# EAGLE design deck (EAGLE 9.1.1)
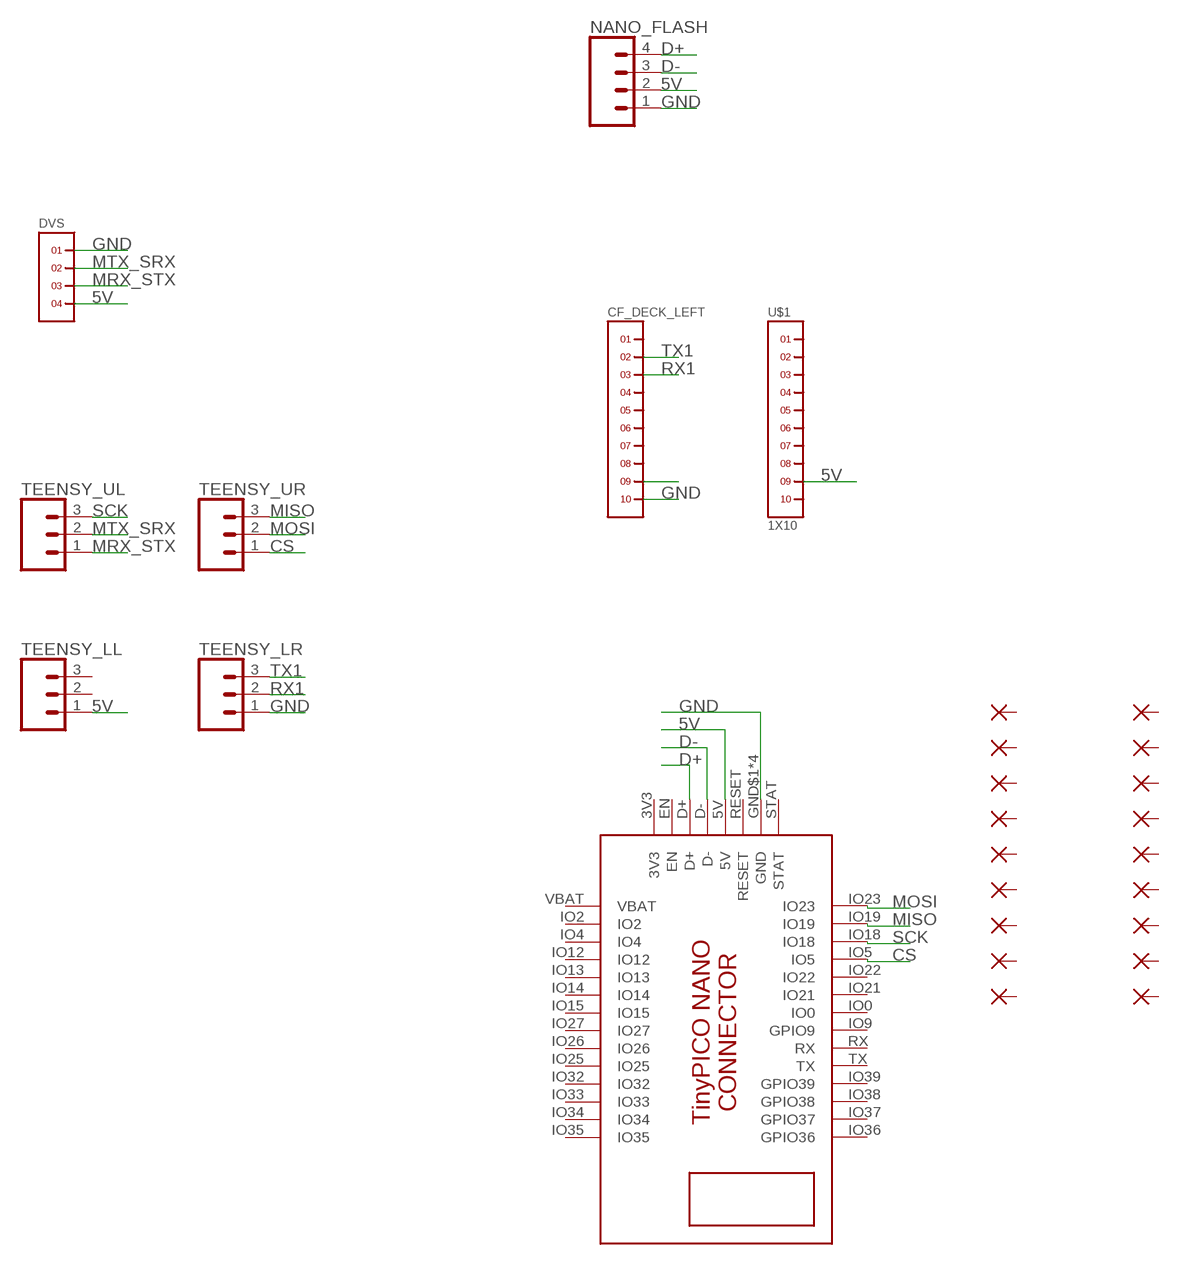
[diagram p0: schematic, sheet 1]

## Parts
CF_DECK_LEFT  1X10  [1X10]
DVS  1X4  [1X4]
NANO_FLASH  CONN_041X04_NO_SILK  [1X04_NO_SILK]
PAD1  SMD2  [SMD1,27-2,54]
PAD2  SMD2  [SMD1,27-2,54]
PAD3  SMD2  [SMD1,27-2,54]
PAD4  SMD2  [SMD1,27-2,54]
PAD5  SMD2  [SMD1,27-2,54]
PAD6  SMD2  [SMD1,27-2,54]
PAD7  SMD2  [SMD1,27-2,54]
PAD8  SMD2  [SMD1,27-2,54]
PAD9  SMD2  [SMD1,27-2,54]
PAD10  SMD2  [SMD1,27-2,54]
PAD11  SMD2  [SMD1,27-2,54]
PAD12  SMD2  [SMD1,27-2,54]
PAD13  SMD2  [SMD1,27-2,54]
PAD14  SMD2  [SMD1,27-2,54]
PAD15  SMD2  [SMD1,27-2,54]
PAD16  SMD2  [SMD1,27-2,54]
PAD17  SMD2  [SMD1,27-2,54]
PAD18  SMD2  [SMD1,27-2,54]
TEENSY_LL  CONN_031X03_NO_SILK  [1X03_NO_SILK]
TEENSY_LR  CONN_031X03_NO_SILK  [1X03_NO_SILK]
TEENSY_UL  CONN_031X03_NO_SILK  [1X03_NO_SILK]
TEENSY_UR  CONN_031X03_NO_SILK  [1X03_NO_SILK]
U$1  1X10  [1X10]
U$4  TINYPICO-NANO-CONNECTOR  [TINYPICO-NANO-CONNECTOR]

## Nets
5V: DVS.4 NANO_FLASH.2 TEENSY_LL.1 U$1.9 U$4.5V
CS: TEENSY_UR.1 U$4.IO5
D+: NANO_FLASH.4 U$4.D+
D-: NANO_FLASH.3 U$4.D-
GND: CF_DECK_LEFT.10 DVS.1 NANO_FLASH.1 TEENSY_LR.1 U$4.GND$1(GND) U$4.GND$2(GND) U$4.GND$3(GND) U$4.GND$4(GND)
IO_4: CF_DECK_LEFT.9
MISO: TEENSY_UR.3 U$4.IO19
MOSI: TEENSY_UR.2 U$4.IO23
MRX_STX: DVS.3 TEENSY_UL.1
MTX_SRX: DVS.2 TEENSY_UL.2
RX1: CF_DECK_LEFT.3 TEENSY_LR.2
SCK: TEENSY_UL.3 U$4.IO18
TX1: CF_DECK_LEFT.2 TEENSY_LR.3
Unconnected: CF_DECK_LEFT.1 CF_DECK_LEFT.4 CF_DECK_LEFT.5 CF_DECK_LEFT.6 CF_DECK_LEFT.7 CF_DECK_LEFT.8 PAD1.1(P) PAD2.1(P) PAD3.1(P) PAD4.1(P) PAD5.1(P) PAD6.1(P) PAD7.1(P) PAD8.1(P) PAD9.1(P) PAD10.1(P) PAD11.1(P) PAD12.1(P) PAD13.1(P) PAD14.1(P) PAD15.1(P) PAD16.1(P) PAD17.1(P) PAD18.1(P) TEENSY_LL.2 TEENSY_LL.3 U$1.1 U$1.2 U$1.3 U$1.4 U$1.5 U$1.6 U$1.7 U$1.8 U$1.10 U$4.EN U$4.IO0 U$4.IO2 U$4.IO4 U$4.IO9(GPIO9) U$4.IO12 U$4.IO13 U$4.IO14 U$4.IO15 U$4.IO21 U$4.IO22 U$4.IO25 U$4.IO26 U$4.IO27 U$4.IO32 U$4.IO33 U$4.IO34 U$4.IO35 U$4.IO36(GPIO36) U$4.IO37(GPIO37) U$4.IO38(GPIO38) U$4.IO39(GPIO39) U$4.RESET U$4.RX U$4.STAT U$4.TX

## Power pins joined to a net without a drawn wire
3V3: U$4.3V3
VBAT: U$4.VBAT

## Library data of the parts
CF_DECK_LEFT U$1 = headers(2mm):1X10
DVS = headers(2mm):1X4
NANO_FLASH = SparkFun-Connectors:CONN_04: Multi connection point. Often used as Generic Header-pin footprint for 0.1 inch spaced/style header connections On any of the 0.1 inch spaced packages, you can populate with these: Break Away Headers - Straight <https://www.sparkfun.com/products/116> (PRT-00116) Break Away Male Headers - Right Angle <https://www.sparkfun.com/products/553> (PRT-00553) Female Headers <https://www.sparkfun.com/products/115> (PRT-00115) Break Away Headers - Machine Pin <https://www.sparkfun.com/products/117> (PRT-00117) Break Away Female Headers - Swiss Machine Pin <https://www.sparkfun.com/products/743> (PRT-00743) For SCREWTERMINALS and SPRING TERMINALS visit here: Screw Terimnals on SparkFun.com <https://www.sparkfun.com/search/results?term=Screw+Terminals> (5mm/3.5mm/2.54mm spacing) This device is also useful as a general connection point to wire up your design to another part of your project. Our various solder wires solder well into these plated through hole pads. Hook-Up Wire - Assortment (Stranded, 22 AWG) <https://www.sparkfun.com/products/11375> (PRT-11375) Hook-Up Wire - Assortment (Solid Core, 22 AWG) <https://www.sparkfun.com/products/11367> (PRT-11367) View the entire wire category on our website here <https://www.sparkfun.com/categories/141> Special notes: Molex polarized connector foot print use with SKU : PRT-08231 with associated crimp pins and housings. 1MM SMD Version SKU: PRT-10208; PROD_ID: CONN-09696
PAD1-PAD18 = wirepad:SMD2: SMD PAD
TEENSY_LL TEENSY_LR TEENSY_UL TEENSY_UR = SparkFun-Connectors:CONN_03: Multi connection point. Often used as Generic Header-pin footprint for 0.1 inch spaced/style header connections On any of the 0.1 inch spaced packages, you can populate with these: Break Away Headers - Straight <https://www.sparkfun.com/products/116> (PRT-00116) Break Away Male Headers - Right Angle <https://www.sparkfun.com/products/553> (PRT-00553) Female Headers <https://www.sparkfun.com/products/115> (PRT-00115) Break Away Headers - Machine Pin <https://www.sparkfun.com/products/117> (PRT-00117) Break Away Female Headers - Swiss Machine Pin <https://www.sparkfun.com/products/743> (PRT-00743) Stackable Header - 3 Pin (Female, 0.1") <https://www.sparkfun.com/products/13875> (PRT-13875) For SCREWTERMINALS and SPRING TERMINALS visit here: Screw Terimnals on SparkFun.com <https://www.sparkfun.com/search/results?term=Screw+Terminals> (5mm/3.5mm/2.54mm spacing) This device is also useful as a general connection point to wire up your design to another part of your project. Our various solder wires solder well into these plated through hole pads. Hook-Up Wire - Assortment (Stranded, 22 AWG) <https://www.sparkfun.com/products/11375> (PRT-11375) Hook-Up Wire - Assortment (Solid Core, 22 AWG) <https://www.sparkfun.com/products/11367> (PRT-11367) View the entire wire category on our website here <https://www.sparkfun.com/categories/141> Special notes: Molex polarized connector foot print use with SKU : PRT-08232 with associated crimp pins and housings.
U$4 = TinyPICO_NANO_Eagle:TINYPICO-NANO-CONNECTOR: TinyPICO NANO Footprint https://www.tinypico.com/tinypico-nano

## Board
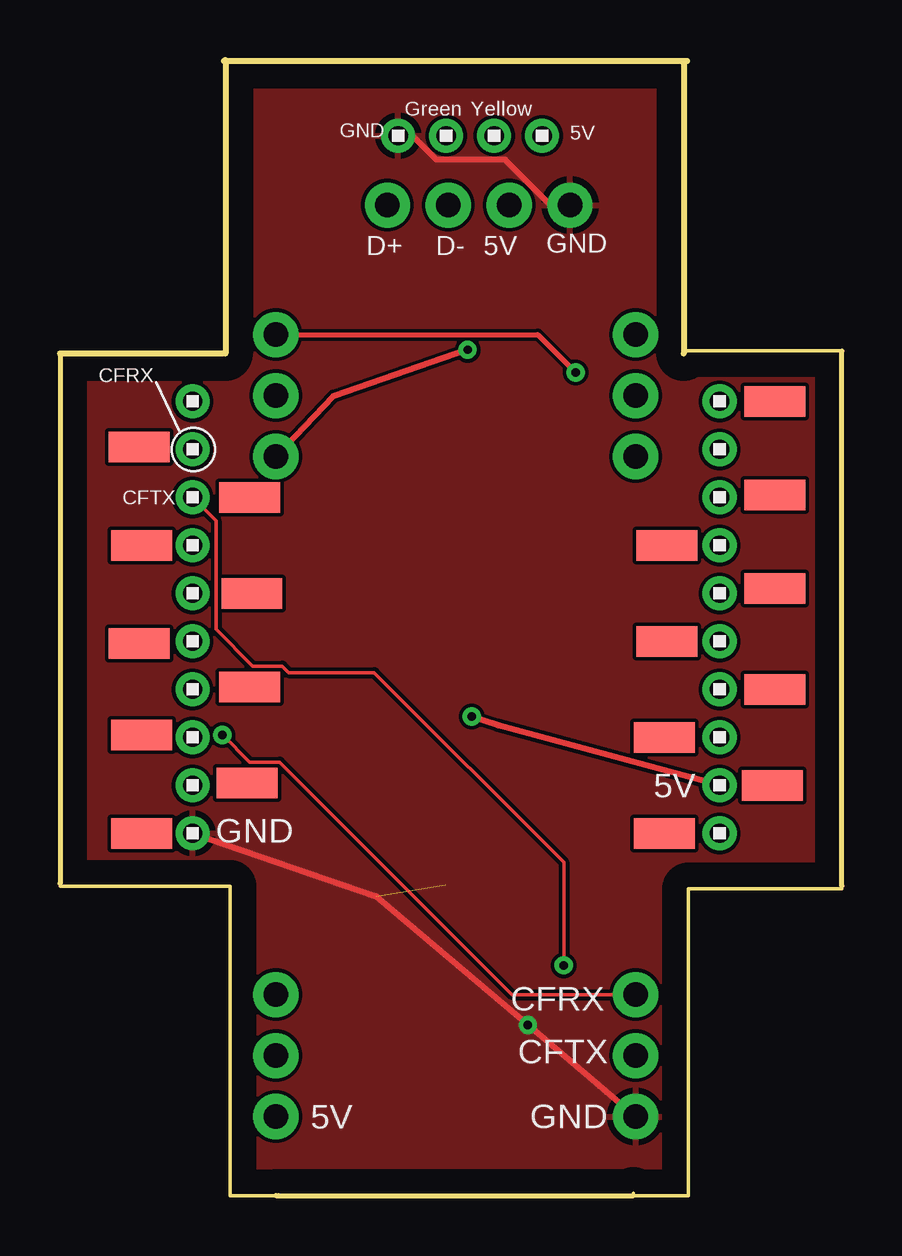
[diagram p1: board, top side]
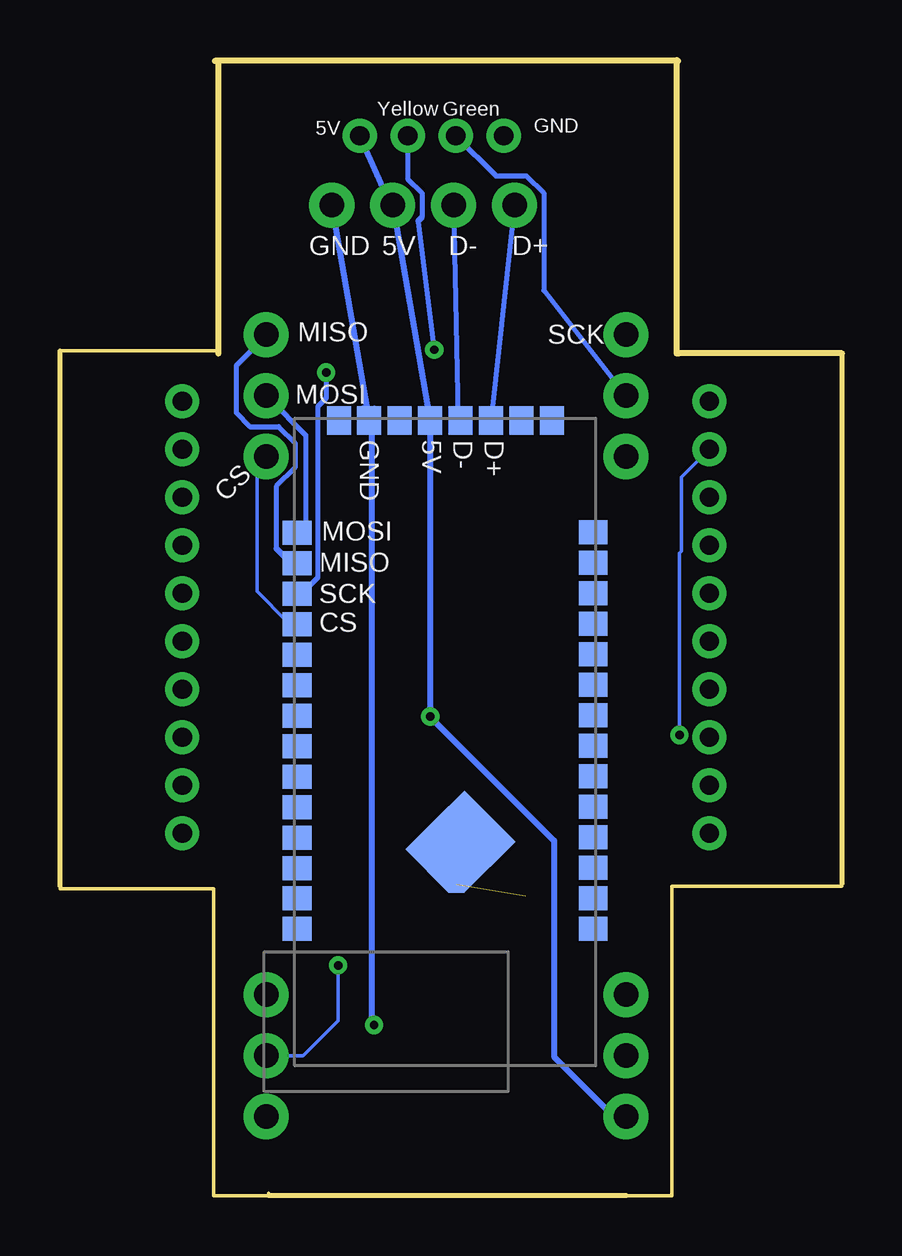
[diagram p2: board, bottom side, seen from below]

Size 32.6 x 47.32 mm. Coordinates in mm from the lower left corner, seen from the top.
Outline: 0,13 0,35.1 6.8,35.1
Outline: 9,0 9.1,0
Outline: 9.1,0 23.9,0
Outline: 32.6,12.9 32.6,35.2 26.1,35.2
Outline: 0,12.9 7.1,12.9 7.1,0 9.1,0
Outline: 32.6,12.8 26.2,12.8 26.2,0 23.9,0
Outline: 23.9,0 23.9,0.1
Outline: 6.9,47.32 6.9,35.1
Outline: 26,47.17 26,35.1
Outline: 6.83,47.28 26.14,47.28
Copper layers (1*16): Top 0.035mm / dielectric 1.5mm / Bottom 0.035mm
Design rules "default": minimum track width 6mil, minimum drill 0.35mm, track to track 6mil, track to pad 6mil, pad to pad 6mil, via to via 6mil, smd to smd 6mil, copper to edge 40mil, drill to drill 6mil, minimum pad ring 10mil, minimum via ring 8mil, stop-mask expansion 4mil, vias tented up to drill 0mil, thermal gap 10mil

### Footprints (pad centres in the part's own frame; a part is rotated, then mirrored left to right if it is on the bottom)
1X10 = drill 0.8 pad 1.422: 1 -9,0; 2 -7,0; 3 -5,0; 4 -3,0; 5 -1,0; 6 1,0; 7 3,0; 8 5,0; 9 7,0; 10 9,0
1X4 = drill 0.8 pad 1.422: 1 -3,0; 2 -1,0; 3 1,0; 4 3,0
1X04_NO_SILK = drill 1.016 pad 1.88: 1 0,0; 2 2.54,0; 3 5.08,0; 4 7.62,0
SMD1,27-2,54 = smd 1.27 x 2.54: 1 0,0
1X03_NO_SILK = drill 1.016 pad 1.88: 1 0,0; 2 2.54,0; 3 5.08,0
TINYPICO-NANO-CONNECTOR = smd 1.2 x 1: 3V3 0.1,10.725; 5V 0.1,5.645; D+ 0.1,8.185; D- 0.1,6.915; EN 0.1,9.455; GND$1 0.1,3.105; RESET 0.1,4.375; STAT 0.1,1.835 | smd 3 x 3 rotated 45: GND$2 17.643,7.082 | smd 0.66 x 0.671: GND$3 19.436,6.746 | smd 2.54 x 2.54 rotated 45: GND$4 17.971,6.413 | smd 1 x 1.2: IO0 12.395,0.1; IO2 6.034,12.44; IO4 7.304,12.44; IO5 8.585,0.1; IO9 13.665,0.1; IO12 8.574,12.44; IO13 9.844,12.44; IO14 11.114,12.44; IO15 12.384,12.44; IO18 7.315,0.1; IO19 6.045,0.1; IO21 11.125,0.1; IO22 9.855,0.1; IO23 4.775,0.1; IO25 16.194,12.44; IO26 14.924,12.44; IO27 13.654,12.44; IO32 17.464,12.44; IO33 18.734,12.44; IO34 20.004,12.44; IO35 21.274,12.44; IO36 21.285,0.1; IO37 20.015,0.1; IO38 18.745,0.1; IO39 17.475,0.1; RX 14.935,0.1; TX 16.205,0.1; VBAT 4.764,12.44

### Placement (x,y rotation side)
CF_DECK_LEFT  5.53,24.1 270 top
DVS  17.1,44.17 0 top
NANO_FLASH  21.27,41.28 180 top
PAD1  3.4,15.1 90 top
PAD2  7.8,17.2 90 top
PAD3  8,25.1 90 top
PAD4  7.9,29.1 90 top
PAD5  29.8,33.1 90 top
PAD6  29.8,29.2 90 top
PAD7  25.3,27.1 90 top
PAD8  25.3,23.1 90 top
PAD9  3.3,31.2 90 top
PAD10  3.4,19.2 90 top
PAD11  7.9,21.2 90 top
PAD12  3.4,27.1 90 top
PAD13  29.7,17.1 90 top
PAD14  25.2,19.1 90 top
PAD15  3.3,23 90 top
PAD16  29.8,21.1 90 top
PAD17  29.8,25.3 90 top
PAD18  25.2,15.1 90 top
TEENSY_LL  9,3.3 90 top
TEENSY_LR  24,3.3 90 top
TEENSY_UL  9,30.8 90 top
TEENSY_UR  24,30.8 90 top
U$1  27.5,24.1 270 top
U$4  22.81,32.4 270 bottom

### Tracks (layer width: path | path; a pad name or v marks a point on that pad's centre or on a via)
5V  (via drill 0.35)
  Top 0.254: U$1.9 18.26,19.6 v17.16,19.96
  Bottom 0.254: U$4.5V | U$4.5V v17.16,19.96 12,14.8 12,5.8 9.5,3.3 TEENSY_LL.1 | NANO_FLASH.2 18.67,40.95 | 18.67,40.95 U$4.5V | DVS.4 18.67,40.95
CS
  Bottom 0.152: U$4.IO5 22.82,23.92 23.12,23.92 24.38,25.18 24.38,30.42 TEENSY_UR.1
D+
  Bottom 0.203: NANO_FLASH.4 U$4.D+
D-
  Bottom 0.152: 16,32.41 U$4.D-
  Bottom 0.203: NANO_FLASH.3 16,32.41
GND  (via drill 0.35)  (1 unrouted)
  Top 0.152: 5.6,15.08 CF_DECK_LEFT.10
  Top 0.254: CF_DECK_LEFT.10 13.18,12.48 v19.5,7.12 TEENSY_LR.1 | NANO_FLASH.1 20.45,41.28 18.55,43.17 15.69,43.17 14.7,44.16 DVS.1
  Bottom 0.152: 19.77,32.8 19.77,32.76 U$4.GND$1 19.62,32.15 19.7,32.23 | 16.42,14.47 U$4.GND$4 | U$4.GND$4 16.26,14.32 16.11,14.17 16.11,13.1 U$4.GND$3 16.11,12.95 | U$4.GND$2 15.81,14.63 16.11,14.63 16.26,14.47 U$4.GND$4
  Bottom 0.254: 19.98,32.8 19.77,32.8 19.5,32.8 | 19.7,32.23 19.62,32.15 19.62,7.23 v19.5,7.12 | NANO_FLASH.1 U$4.GND$1
  pour Top: -1.4,53.7 35,53.7 35,-1.9 -1.4,-1.9
MISO
  Bottom 0.152: 22.82,26.36 U$4.IO19 | 24.04,35.81 TEENSY_UR.3
  Bottom 0.203: 23.58,26.97 23.58,29.56 22.8,30.34 22.8,31.37 23.48,32.05 24.69,32.05 25.26,32.62 25.26,34.59 24.04,35.81
  Bottom 0.254: 23.58,26.97 22.97,26.36 22.82,26.36
MOSI
  Bottom 0.152: 23.88,33.22 TEENSY_UR.2
  Bottom 0.203: 23.88,33.22 22.35,31.69 22.35,27.98 U$4.IO23
MRX_STX  (via drill 0.35)
  Top 0.254: v16.99,35.25 11.41,33.31 TEENSY_UL.1
  Bottom 0.152: 9.1,30.93 TEENSY_UL.1
  Bottom 0.203: 17.51,40.77 17.51,41.78 18.1,42.37 DVS.3 | 17.67,40.61 16.99,35.09
  Bottom 0.254: 17.51,40.77 17.67,40.61 | 16.99,35.09 v16.99,35.25
MTX_SRX
  Bottom 0.203: 9,33.77 TEENSY_UL.2 12.43,37.72 12.43,41.78 13.14,42.5 14.43,42.5 DVS.2
RX1  (via drill 0.35 pad 0.2)
  Top 0.152: CF_DECK_LEFT.3 6.5,28.13 6.5,23.6 8.04,22.06 9.27,22.06 9.53,21.8 13.1,21.8 21,13.9 v21,9.6
  Bottom 0.152: TEENSY_LR.2 22.46,5.84 21,7.3 v21,9.6
SCK  (via drill 0.35)
  Top 0.203: TEENSY_UL.3 19.92,35.88 v21.5,34.3
  Bottom 0.203: v21.5,34.3 21.5,33.23 21.86,32.88 21.86,25.75 22.5,25.1 23.19,25.1 23.18,25.09 U$4.IO18
TX1  (via drill 0.35 pad 0.2)
  Top 0.152: v6.77,19.2 7.91,18.06 9.16,18.06 18.85,8.38 TEENSY_LR.3
  Bottom 0.152: v6.77,19.2 6.77,26.77 6.69,26.85 6.69,29.94 CF_DECK_LEFT.2
VBAT
  Bottom 0.152: 10.32,27.73 U$4.VBAT

### Text on the board
tNames: Green | Yellow | GND | 5V | D+ | D- | 5V | GND | CFRX | CFTX | 5V | GND | CFRX | CFTX | 5V | GND
bNames: Green | Yellow | GND | 5V | D+ | D- | 5V | GND | SCK | MISO | MOSI | D+ | D- | 5V | GND | CS | MOSI | MISO | SCK | CS